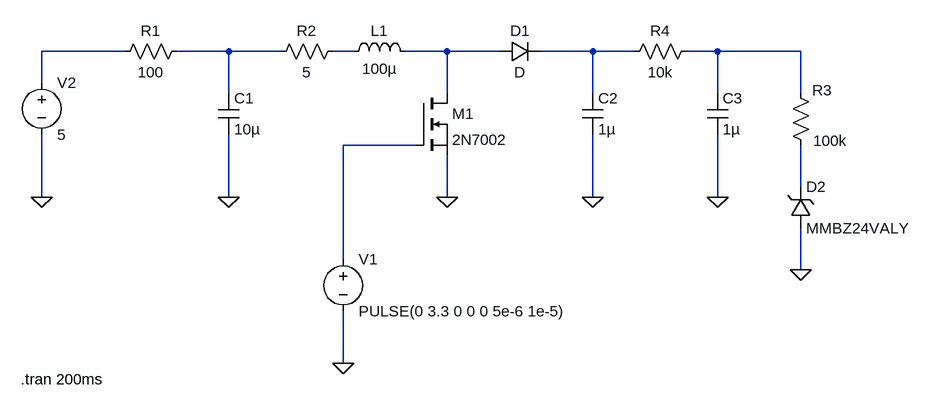
[diagram p0: schematic BoostPump.asc]
BoostPump.asc, the LTspice schematic file:
Version 4
SHEET 1 1116 680
WIRE -96 -80 -224 -80
WIRE 64 -80 -16 -80
WIRE 144 -80 64 -80
WIRE 256 -80 224 -80
WIRE 400 -80 336 -80
WIRE 480 -80 400 -80
WIRE 624 -80 544 -80
WIRE 688 -80 624 -80
WIRE 816 -80 768 -80
WIRE 944 -80 816 -80
WIRE -224 -32 -224 -80
WIRE 64 -16 64 -80
WIRE 400 -16 400 -80
WIRE 624 -16 624 -80
WIRE 816 -16 816 -80
WIRE 944 -16 944 -80
WIRE 352 64 240 64
WIRE 944 128 944 64
WIRE -224 144 -224 48
WIRE 64 144 64 48
WIRE 400 144 400 80
WIRE 624 144 624 48
WIRE 816 144 816 48
WIRE 240 240 240 64
WIRE 944 256 944 192
WIRE 240 400 240 320
FLAG 64 144 0
FLAG 400 144 0
FLAG 624 144 0
FLAG 944 256 0
FLAG 240 400 0
FLAG -224 144 0
FLAG 816 144 0
SYMBOL res 0 -96 R90
WINDOW 0 0 56 VBottom 2
WINDOW 3 32 56 VTop 2
SYMATTR InstName R1
SYMATTR Value 100
SYMBOL res 240 -96 R90
WINDOW 0 0 56 VBottom 2
WINDOW 3 32 56 VTop 2
SYMATTR InstName R2
SYMATTR Value 5
SYMBOL res 960 80 R180
WINDOW 0 -32 100 Left 2
WINDOW 3 -56 23 Left 2
SYMATTR InstName R3
SYMATTR Value 100k
SYMBOL cap 48 -16 R0
SYMATTR InstName C1
SYMATTR Value 10µ
SYMBOL cap 608 -16 R0
SYMATTR InstName C2
SYMATTR Value 1µ
SYMBOL ind 240 -64 R270
WINDOW 0 32 56 VTop 2
WINDOW 3 5 56 VBottom 2
SYMATTR InstName L1
SYMATTR Value 100µ
SYMBOL diode 480 -64 R270
WINDOW 0 32 32 VTop 2
WINDOW 3 0 32 VBottom 2
SYMATTR InstName D1
SYMBOL nmos 352 -16 R0
SYMATTR InstName M1
SYMATTR Value 2N7002
SYMBOL voltage 240 224 R0
WINDOW 123 0 0 Left 0
WINDOW 39 0 0 Left 0
SYMATTR InstName V1
SYMATTR Value PULSE(0 3.3 0 0 0 5e-6 1e-5)
SYMBOL voltage -224 -48 R0
WINDOW 123 0 0 Left 0
WINDOW 39 0 0 Left 0
SYMATTR InstName V2
SYMATTR Value 5
SYMBOL cap 800 -16 R0
SYMATTR InstName C3
SYMATTR Value 1µ
SYMBOL res 784 -96 R90
WINDOW 0 0 56 VBottom 2
WINDOW 3 32 56 VTop 2
SYMATTR InstName R4
SYMATTR Value 10k
SYMBOL zener 928 192 M180
WINDOW 0 24 64 Left 2
WINDOW 3 24 0 Left 2
SYMATTR InstName D2
SYMATTR Value MMBZ24VALY
TEXT -256 424 Left 2 !.tran 200ms

The netlist it stands for:
* BoostPump.asc
R1 N002 N001 100
R2 N003 N002 5
R3 N008 N006 100k
C1 N002 0 10µ
C2 N005 0 1µ
L1 N003 N004 100µ
D1 N004 N005 D
M1 N004 N007 0 0 2N7002
V1 N007 0 PULSE(0 3.3 0 0 0 5e-6 1e-5)
V2 N001 0 5
C3 N006 0 1µ
R4 N006 N005 10k
D2 0 N008 MMBZ24VALY
.model D D
.lib standard.dio
.model NMOS NMOS
.model PMOS PMOS
.lib standard.mos
.tran 200ms
.backanno
.end